# EAGLE design aether_A (EAGLE 5.11)
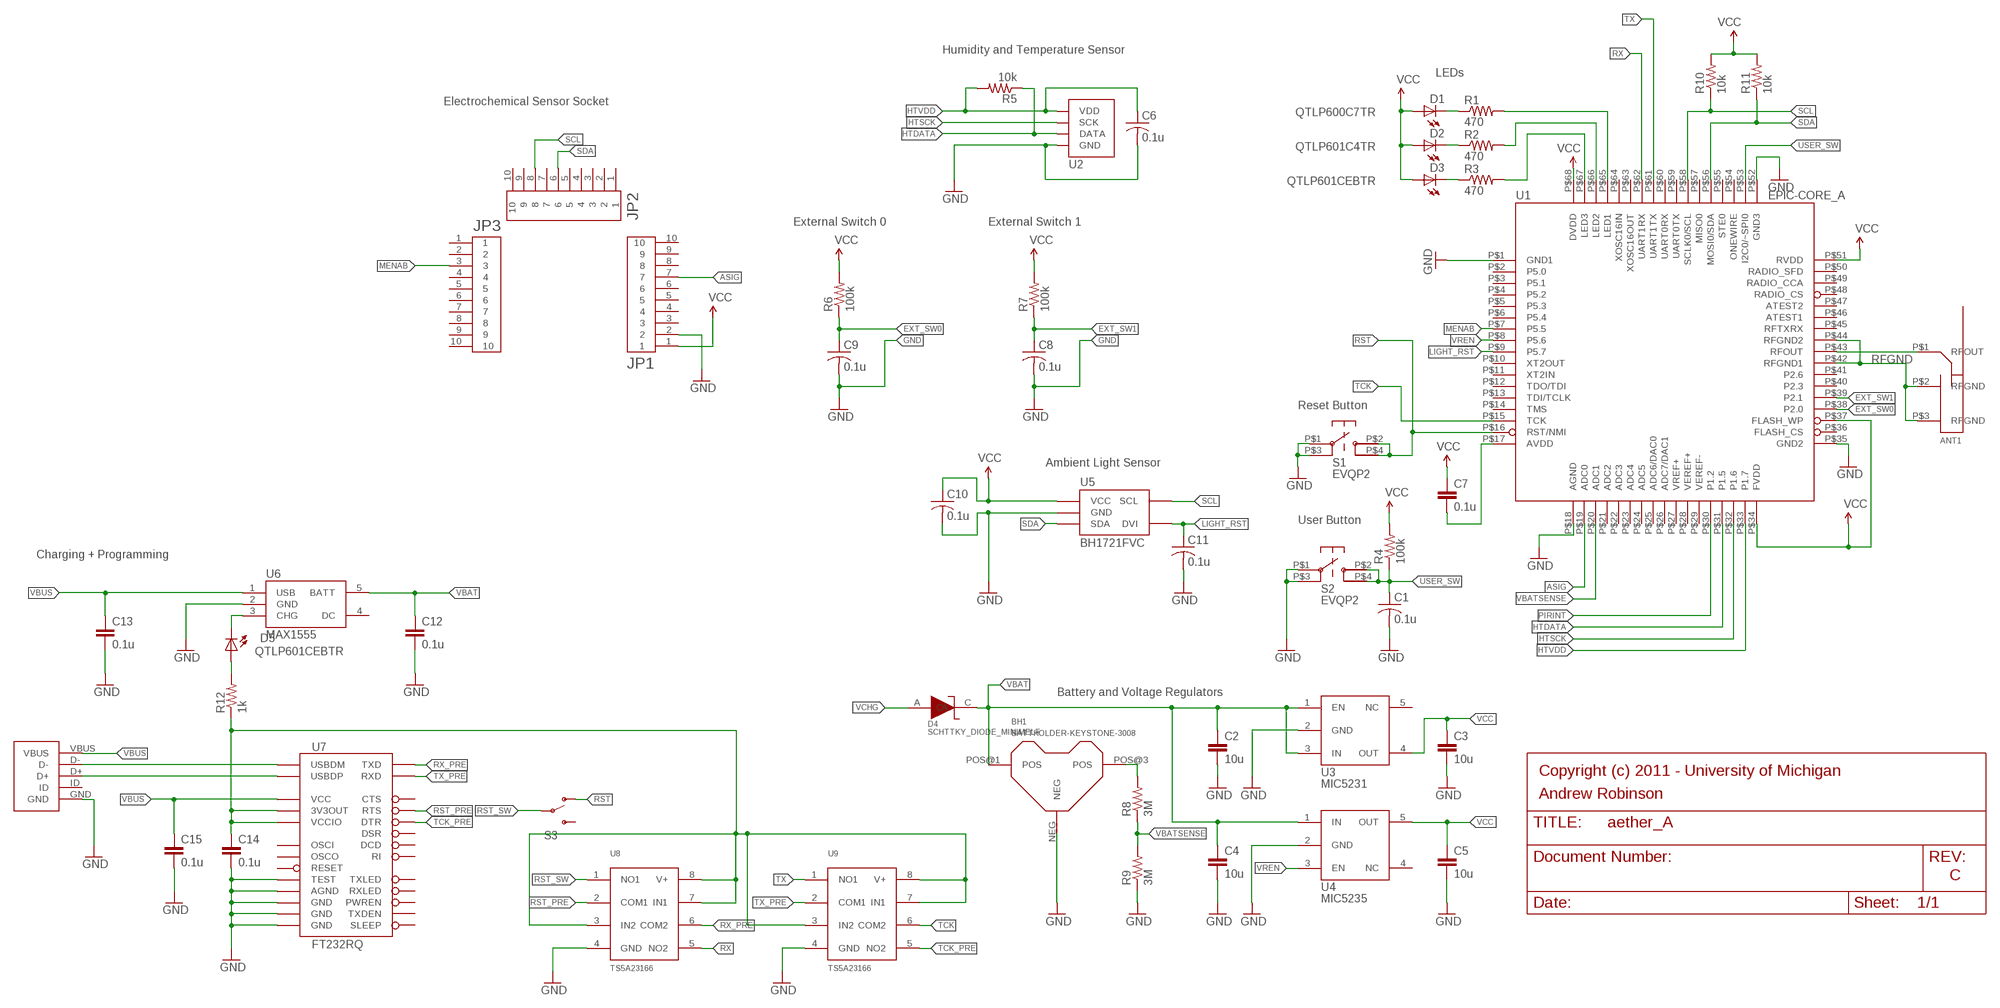
[diagram p0: schematic, sheet 1]

## Parts
ANT1  PIFA-2.4GHZ  [PIFA-2.4GHZ]
BH1  BATTHOLDER-KEYSTONE-3008  [BATTHOLDER-KEYSTONE-3008]
C1  0.1u  C-USC0603  [C0603]
C2  10u  C-EUC0603  [C0603]
C3  10u  C-EUC0603  [C0603]
C4  10u  C-EUC0603  [C0603]
C5  10u  C-EUC0603  [C0603]
C6  0.1u  C-USC0603  [C0603]
C7  0.1u  C-EUC0603  [C0603]
C8  0.1u  C-USC0603  [C0603]
C9  0.1u  C-USC0603  [C0603]
C10  0.1u  C-USC0603  [C0603]
C11  0.1u  C-USC0603  [C0603]
C12  0.1u  C-EUC0603  [C0603]
C13  0.1u  C-EUC0603  [C0603]
C14  0.1u  C-EUC0603  [C0603]
C15  0.1u  C-EUC0603  [C0603]
D1  QTLP600C7TR  LED0603  [LED-0603]
D2  QTLP601C4TR  LED0603  [LED-0603]
D3  QTLP601CEBTR  LED0603  [LED-0603]
D4  SCHTTKY_DIODE_MINIMELF  [SCHOTTKY_DIODE_MINIMELF]
D5  QTLP601CEBTR  LED0603  [LED-0603]
JP1  SAMTEC-2MM-SMT-10PINSTD  [2MM-10PIN-SMHEADER]
JP2  SAMTEC-2MM-SMT-10PINSTD  [2MM-10PIN-SMHEADER]
JP3  SAMTEC-2MM-SMT-10PINSTD  [2MM-10PIN-SMHEADER]
JP4  USB_MICRO_B_FEMALE  [USB_MICRO_B_FEMALE]
R1  470  R-US_R0603  [R0603]
R2  470  R-US_R0603  [R0603]
R3  470  R-US_R0603  [R0603]
R4  100k  R-US_R0603  [R0603]
R5  10k  R-US_R0603  [R0603]
R6  100k  R-US_R0603  [R0603]
R7  100k  R-US_R0603  [R0603]
R8  3M  R-US_R0603  [R0603]
R9  3M  R-US_R0603  [R0603]
R10  10k  R-US_R0603  [R0603]
R11  10k  R-US_R0603  [R0603]
R12  1k  R-US_R0603  [R0603]
S1  EVQP2  [EVQP2]
S2  EVQP2  [EVQP2]
S3  SWITCH-SPSTPTH  [SWITCH-SPDT]
U1  EPIC-CORE_A  [EPIC-LCC68]
U2  SHT1XSMD  [SHT1X]
U3  MIC5231  [SOT23-5]
U4  MIC5235  [SOT23-5]
U5  BH1721FVC  [WSOF5]
U6  MAX1555  [SOT23-5]
U7  FT232RQ  [QFN-32]
U8  TS5A23166  [WCSP-8]
U9  TS5A23166  [WCSP-8]

## Nets
ASIG: JP1.7 U1.P$19(ADC0)
EXT_SW0: C9.1 R6.1 U1.P$38(P2.0)
EXT_SW1: C8.1 R7.1 U1.P$39(P2.1)
GND: BH1.NEG C1.2 C2.2 C3.2 C4.2 C5.2 C6.2 C8.2 C9.2 C10.2 C11.2 C12.2 C13.2 C14.2 C15.2 JP1.2 JP4.GND R9.1 S1.P$1 S1.P$3 S2.P$1 S2.P$3 U1.P$1(GND1) U1.P$18(AGND) U1.P$35(GND2) U1.P$52(GND3) U2.1(GND) U3.2(GND) U4.2(GND) U5.GND U6.2(GND) U7.4(GND) U7.17(GND) U7.20(GND) U7.24(AGND) U7.26(TEST) U8.4(GND) U9.4(GND)
HTDATA: R5.1 U1.P$31(P1.5) U2.2(DATA)
HTSCK: U1.P$32(P1.6) U2.3(SCK)
HTVDD: C6.1 R5.2 U1.P$33(P1.7) U2.4(VDD)
LIGHT_RST: C11.1 U1.P$9(P5.7) U5.DVI
MENAB: JP3.3 U1.P$7(P5.5)
N$1: ANT1.P$1(RFOUT) U1.P$43(RFOUT)
N$2: C7.2 U1.P$17(AVDD)
N$3: C14.1 R12.1 U7.1(VCCIO) U7.16(3V3OUT) U8.3(IN2) U8.7(IN1) U8.8(V+) U9.3(IN2) U9.7(IN1) U9.8(V+)
N$4: JP4.D- U7.15(USBDM)
N$6: D1.C R1.1
N$7: D2.C R2.1
N$8: D3.C R3.1
N$9: R1.2 U1.P$65(LED1)
N$10: R2.2 U1.P$66(LED2)
N$11: R3.2 U1.P$67(LED3)
N$12: D5.C U6.3(CHG)
N$13: JP4.D+ U7.14(USBDP)
N$14: D5.A R12.2
N$16: BH1.POS@3(POS) R8.2
PIRINT: U1.P$30(P1.2)
RFGND: ANT1.P$2(RFGND) ANT1.P$3(RFGND) U1.P$42(RFGND1) U1.P$44(RFGND2)
RST: S1.P$2 S1.P$4 S3.1(O) U1.P$16(RST/NMI)
RST_PRE: U7.32(RTS) U8.2(COM1)
RST_SW: S3.2(P) U8.1(NO1)
RX: U1.P$62(UART1RX) U8.5(NO2)
RX_PRE: U7.30(TXD) U8.6(COM2)
SCL: JP2.8 R10.1 U1.P$58(SCLK0/SCL) U5.SCL
SDA: JP2.6 R11.1 U1.P$56(MOSI0/SDA) U5.SDA
TCK: U1.P$15(TCK) U9.6(COM2)
TCK_PRE: U7.31(DTR) U9.5(NO2)
TX: U1.P$61(UART1TX) U9.1(NO1)
TX_PRE: U7.2(RXD) U9.2(COM1)
USER_SW: C1.1 R4.1 S2.P$2 S2.P$4 U1.P$53(I2C0/~SPI0)
VBAT: BH1.POS@1(POS) C2.1 C4.1 C12.1 D4.C U3.1(EN) U3.3(IN) U4.1(IN) U6.5(BATT)
VBATSENSE: R8.1 R9.2 U1.P$20(ADC1)
VBUS: C13.1 C15.1 JP4.VBUS U6.1(USB) U7.19(VCC)
VCC: C3.1 C5.1 C7.1 C10.1 D1.A D2.A D3.A JP1.1 R4.2 R6.2 R7.2 R10.2 R11.2 U1.P$34(FVDD) U1.P$37(FLASH_WP) U1.P$51(RVDD) U1.P$68(DVDD) U3.4(OUT) U4.5(OUT) U5.VCC
VCHG: D4.A
VREN: U1.P$8(P5.6) U4.3(EN)
Unconnected: JP1.3 JP1.4 JP1.5 JP1.6 JP1.8 JP1.9 JP1.10 JP2.1 JP2.2 JP2.3 JP2.4 JP2.5 JP2.7 JP2.9 JP2.10 JP3.1 JP3.2 JP3.4 JP3.5 JP3.6 JP3.7 JP3.8 JP3.9 JP3.10 JP4.ID S3.3(S) U1.P$2(P5.0) U1.P$3(P5.1) U1.P$4(P5.2) U1.P$5(P5.3) U1.P$6(P5.4) U1.P$10(XT2OUT) U1.P$11(XT2IN) U1.P$12(TDO/TDI) U1.P$13(TDI/TCLK) U1.P$14(TMS) U1.P$21(ADC2) U1.P$22(ADC3) U1.P$23(ADC4) U1.P$24(ADC5) U1.P$25(ADC6/DAC0) U1.P$26(ADC7/DAC1) U1.P$27(VREF+) U1.P$28(VEREF+) U1.P$29(VEREF-) U1.P$36(FLASH_CS) U1.P$40(P2.3) U1.P$41(P2.6) U1.P$45(RFTXRX) U1.P$46(ATEST1) U1.P$47(ATEST2) U1.P$48(RADIO_CS) U1.P$49(RADIO_CCA) U1.P$50(RADIO_SFD) U1.P$54(ONEWIRE) U1.P$55(STE0) U1.P$57(MISO0) U1.P$59(UART0TX) U1.P$60(UART0RX) U1.P$63(XOSC16OUT) U1.P$64(XOSC16IN) U3.5(NC) U4.4(NC) U6.4(DC) U7.3(RI) U7.6(DSR) U7.7(DCD) U7.8(CTS) U7.9(SLEEP) U7.10(TXDEN) U7.11(PWREN) U7.18(RESET) U7.21(RXLED) U7.22(TXLED) U7.27(OSCI) U7.28(OSCO)

## Notes on the sheet
- Humidity and Temperature Sensor
- LEDs
- Electrochemical Sensor Socket
- External Switch 0 | External Switch 1
- Reset Button
- Ambient Light Sensor
- User Button
- Charging + Programming
- Battery and Voltage Regulators
- Copyright (c) 2011 - University of Michigan
- Andrew Robinson
- C

## Library data of the parts
ANT1 = berkeley-epic:PIFA-2.4GHZ
BH1 = berkeley-epic:BATTHOLDER-KEYSTONE-3008
C1 C6 C8-C11 = rcl:C-US: CAPACITOR, American symbol
C2-C5 C7 C12-C15 = rcl:C-EU: CAPACITOR, European symbol
D1-D3 D5 = berkeley-epic:LED: LEDs Standard schematic elements and footprints for 5mm, 3mm, 1206, and 0603 sized LEDs. 5mm - Spark Fun Electronics SKU : COM-00529 (and others)
D4 = berkeley-epic:SCHTTKY_DIODE_MINIMELF
JP1-JP3 = androbin_umich:SAMTEC-2MM-SMT-10PIN
JP4 = usb:USB_MICRO_B_FEMALE
R1-R12 = rcl:R-US_: RESISTOR, American symbol
S1 S2 = berkeley-epic:EVQP2
S3 = SparkFun:SWITCH-SPST: SPST Switch Simple slide switch. Spark Fun Electronics SKU : COM-00102
U1 = berkeley-epic:EPIC-CORE_A
U2 = berkeley-epic:SHT1X: SHT1x Humdity Sensor Sensirion humdity sensor. Schematic element and footprint proven. Spark Fun Electronics SKU : COM-08227
U3 = berkeley-epic:MIC5231
U4 = berkeley-epic:MIC5235
U5 = brad:BH1721FVC: Digital output type ambient light sensor IC is composed of photodiodes, current-voltage converter circuit, A / D converter, control logic circuits, interface circuits and etc. It connects with I2C BUS in an equipment.
U6 = SparkFun:MAX1555: MAX1555 Lithium Charger IC SOT-23 Lithium Polymer charging IC. Schematic element and footprint proven. Spark Fun Electronics SKU : COM-00674
U7 = SparkFun:FT232RQ: Non-stock item, unproven FP for this part.
U8 U9 = berkeley-epic:TS5A23166

## Board
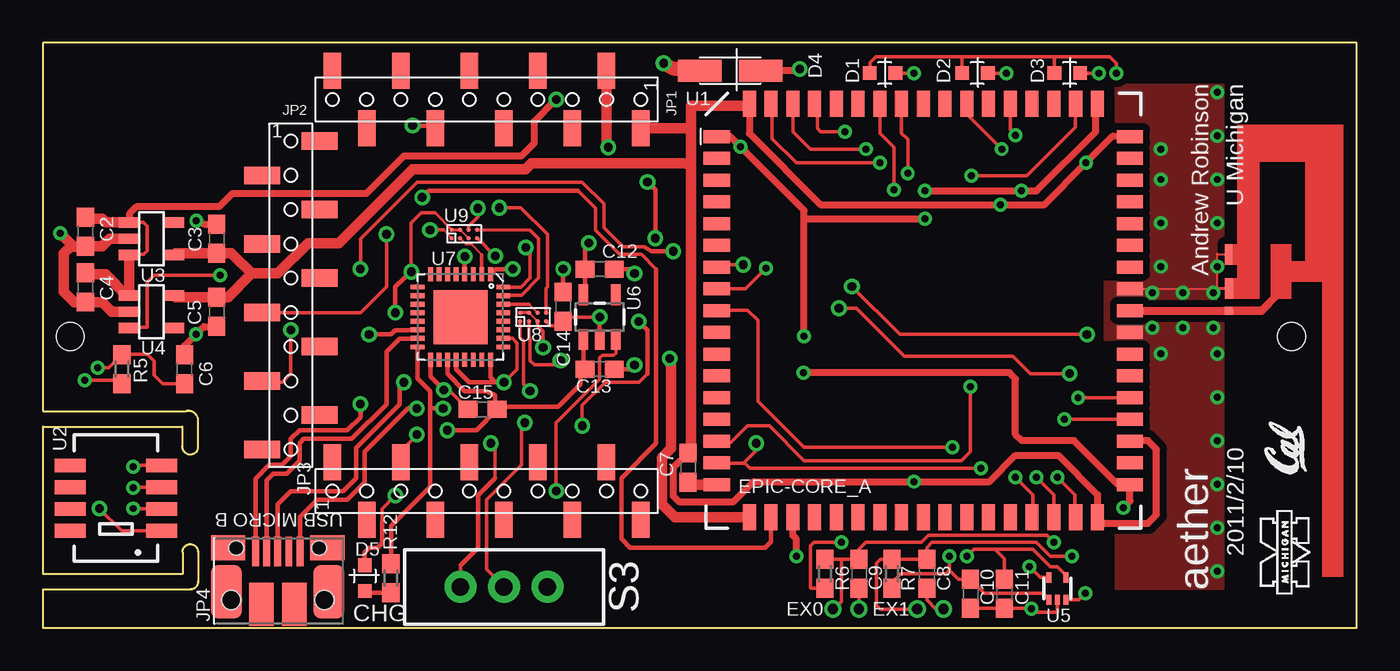
[diagram p1: board, top side]
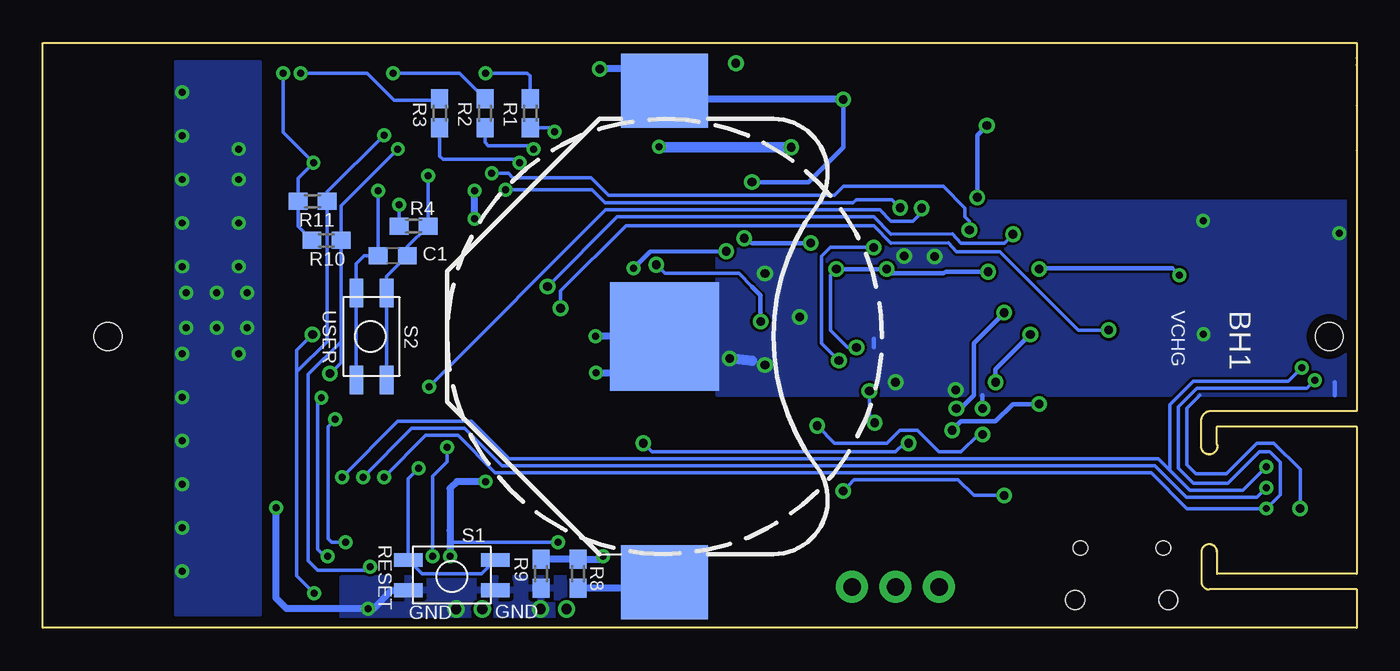
[diagram p2: board, bottom side, seen from below]

Size 76.71 x 34.14 mm. Coordinates in mm from the lower left corner, seen from the top.
Outline: 0,33.25 0,32.84
Outline: 0,30.48 0,27.86
Outline: 76.71,0 76.71,34.14 0,34.14 0,12.65 8.36,12.65 arc-90 9.07,12.19 9.07,10.46 arc-180 8.15,10.72 8.15,11.73 0,11.73 0,3.15 8.15,3.15 8.15,4.42 arc-180 9.07,4.42 9.07,2.69 arc-90 8.61,2.24 0,2.24 0,0 76.71,0
Copper layers (1*16): Top 0.0178mm / dielectric 1.4986mm / Bottom 0.0178mm
Design rules "SSC-EAGLE-2Lyr_v1.0.0.3 *": minimum track width 6mil, minimum drill 14mil, track to track 6mil, track to pad 6mil, pad to pad 6mil, via to via 6mil, smd to smd 6mil, copper to edge 20mil, drill to drill 16mil, minimum pad ring 8mil, minimum via ring 8mil, stop-mask expansion 3mil, vias tented up to drill 20mil, thermal gap 10mil
Holes 1.6 mm at 1.59,17 72.91,17

### Footprints (pad centres in the part's own frame; a part is rotated, then mirrored left to right if it is on the bottom)
PIFA-2.4GHZ = smd 0.46 x 0.46: P$1 -2.65,-1.495 | smd 0.46 x 1.2: P$2 -2.655,1.785; P$3 -2.65,-0.215
BATTHOLDER-KEYSTONE-3008 = smd 6.35 x 6.35: NEG 0,0 | smd 4.318 x 5.08: POS@1 -14.351,0; POS@3 14.351,0
C0603 = smd 1.1 x 1: 1 -0.85,0; 2 0.85,0
LED-0603 = smd 0.8 x 0.8: A 0,-0.75; C 0,0.75
SCHOTTKY_DIODE_MINIMELF = smd 2.54 x 1.27: A -1.778,0; C 1.778,0
2MM-10PIN-SMHEADER = smd 1.016 x 2.1: 1 -9,1.677; 2 -7,-1.677; 3 -5,1.677; 4 -3,-1.677; 5 -1,1.677; 6 1,-1.677; 7 3,1.677; 8 5,-1.677; 9 7,1.677; 10 9,-1.677
USB_MICRO_B_FEMALE = smd 0.4 x 1.75: D+ 0,2.825; D- -0.65,2.825; GND 1.3,2.825; ID 0.65,2.825; VBUS -1.3,2.825 | smd 1.425 x 2.5: P$6 0.963,-0.25; P$7 -0.963,-0.25 | smd 2 x 1.46: P$8 2.9,3.03; P$9 -2.9,3.03 | smd 1.825 x 3.15: P$10 2.987,0.475; P$11 -2.987,0.475 | hole 0.828: 2.425,3.03; -2.425,3.03 | hole 1.081: 2.725,0; -2.725,0
R0603 = smd 1.1 x 1: 1 -0.85,0; 2 0.85,0
EVQP2 = smd 1.676 x 0.813: P$1 -2.54,-0.87; P$2 -2.54,0.908; P$3 2.54,-0.87; P$4 2.54,0.908
SWITCH-SPDT = drill 1.016 pad 1.88 round: 1 0,2.54; 2 0,0; 3 0,-2.54
EPIC-LCC68 = smd 1.524 x 0.762: P$1 -12.065,10.16; P$2 -12.065,8.89; P$3 -12.065,7.62; P$4 -12.065,6.35; P$5 -12.065,5.08; P$6 -12.065,3.81; P$7 -12.065,2.54; P$8 -12.065,1.27; P$9 -12.065,0; P$10 -12.065,-1.27; P$11 -12.065,-2.54; P$12 -12.065,-3.81; P$13 -12.065,-5.08; P$14 -12.065,-6.35; P$15 -12.065,-7.62; P$16 -12.065,-8.89; P$17 -12.065,-10.16; P$35 12.065,-10.16; P$36 12.065,-8.89; P$37 12.065,-7.62; P$38 12.065,-6.35; P$39 12.065,-5.08; P$40 12.065,-3.81; P$41 12.065,-2.54; P$42 12.065,-1.27; P$43 12.065,0; P$44 12.065,1.27; P$45 12.065,2.54; P$46 12.065,3.81; P$47 12.065,5.08; P$48 12.065,6.35; P$49 12.065,7.62; P$50 12.065,8.89; P$51 12.065,10.16 | smd 0.762 x 1.524: P$18 -10.16,-12.065; P$19 -8.89,-12.065; P$20 -7.62,-12.065; P$21 -6.35,-12.065; P$22 -5.08,-12.065; P$23 -3.81,-12.065; P$24 -2.54,-12.065; P$25 -1.27,-12.065; P$26 0,-12.065; P$27 1.27,-12.065; P$28 2.54,-12.065; P$29 3.81,-12.065; P$30 5.08,-12.065; P$31 6.35,-12.065; P$32 7.62,-12.065; P$33 8.89,-12.065; P$34 10.16,-12.065; P$52 10.16,12.065; P$53 8.89,12.065; P$54 7.62,12.065; P$55 6.35,12.065; P$56 5.08,12.065; P$57 3.81,12.065; P$58 2.54,12.065; P$59 1.27,12.065; P$60 0,12.065; P$61 -1.27,12.065; P$62 -2.54,12.065; P$63 -3.81,12.065; P$64 -5.08,12.065; P$65 -6.35,12.065; P$66 -7.62,12.065; P$67 -8.89,12.065; P$68 -10.16,12.065
SHT1X = smd 1.8 x 0.8: 1 -2.667,1.905; 2 -2.667,0.635; 3 -2.667,-0.635; 4 -2.667,-1.905; 5 2.667,-1.905; 6 2.667,-0.635; 7 2.667,0.635; 8 2.667,1.905
SOT23-5 = smd 0.6 x 1.2: 1 -0.95,-1.306; 2 0,-1.306; 3 0.95,-1.306; 4 0.95,1.306; 5 -0.95,1.306
WSOF5 = smd 0.3 x 0.6: DVI 0.5,0.65; GND 0,-0.65; SCL -0.5,0.65; SDA 0.5,-0.65; VCC -0.5,-0.65
SOT23-5' = smd 0.55 x 1.2: 1 -0.95,-1.3; 2 0,-1.3; 3 0.95,-1.3; 4 0.95,1.3; 5 -0.95,1.3
QFN-32 = smd 0.285 x 0.8: 1 -1.75,-2.5; 2 -1.25,-2.5; 3 -0.75,-2.5; 4 -0.25,-2.5; 5 0.25,-2.5; 6 0.75,-2.5; 7 1.25,-2.5; 8 1.75,-2.5; 17 1.75,2.5; 18 1.25,2.5; 19 0.75,2.5; 20 0.25,2.5; 21 -0.25,2.5; 22 -0.75,2.5; 23 -1.25,2.5; 24 -1.75,2.5 | smd 0.8 x 0.285: 9 2.5,-1.75; 10 2.5,-1.25; 11 2.5,-0.75; 12 2.5,-0.25; 13 2.5,0.25; 14 2.5,0.75; 15 2.5,1.25; 16 2.5,1.75; 25 -2.5,1.75; 26 -2.5,1.25; 27 -2.5,0.75; 28 -2.5,0.25; 29 -2.5,-0.25; 30 -2.5,-0.75; 31 -2.5,-1.25; 32 -2.5,-1.75 | smd 3.15 x 3.15: EP 0,0
WCSP-8 = smd 0.25 x 0.25: 1 -0.25,0.75; 2 -0.25,0.25; 3 -0.25,-0.25; 4 -0.25,-0.75; 5 0.25,-0.75; 6 0.25,-0.25; 7 0.25,0.25; 8 0.25,0.75

### Placement (x,y rotation side)
ANT1  71.88,20 0 top
BH1  40.41,17 270 bottom
C1  56.28,21.72 180 bottom
C2  2.49,23.11 270 top
C3  10.16,22.71 90 top
C4  2.49,19.86 270 top
C5  10.16,18.44 270 top
C6  8.28,15.09 90 top
C7  37.67,9.35 270 top
C8  51.61,3.15 270 top
C9  47.65,3.15 270 top
C10  54.15,1.98 270 top
C11  56.13,1.98 270 top
C12  32.51,20.93 0 top
C13  32.51,15.09 0 top
C14  30.38,18.75 270 top
C15  25.68,12.75 180 top
D1  49.03,32.37 270 top
D2  54.42,32.37 270 top
D3  59.81,32.37 270 top
D4  40.13,32.51 0 top
D5  18.8,2.9 0 top
JP1  25.91,30.84 180 top
JP2  14.48,19.41 270 top
JP3  25.91,7.98 0 top
JP4  13.72,1.63 0 top
R1  48.25,30.03 270 bottom
R2  50.89,30.03 270 bottom
R3  53.53,30.03 270 bottom
R4  55.06,23.44 180 bottom
R5  4.62,15.09 90 top
R6  45.67,3.15 270 top
R7  49.58,3.15 270 top
R8  45.47,3.15 270 bottom
R9  47.62,3.15 90 bottom
R10  60.15,22.61 180 bottom
R11  60.96,24.89 180 bottom
R12  20.32,2.9 270 top
S1  52.83,3.05 0 bottom
S2  57.53,17 270 bottom
S3  26.92,2.39 90 top
U1  51.41,18.51 0 top
U2  4.27,7.57 180 top
U3  6.35,22.71 270 top
U4  6.35,18.44 270 top
U5  59.23,2.29 0 top
U6  MAX1555  [SOT23-5']  32.51,18.14 0 top
U7  24.38,18.14 180 top
U8  28.63,18.14 90 top
U9  24.61,22.99 90 top
U$1  [UMICH]  74.17,1.88 90 top
U$3  [CAL1]  74.17,8.89 90 top

### Tracks (layer width: path | path; a pad name or v marks a point on that pad's centre or on a via)
ASIG  (via drill 0.51)
  Top 0.203: 35.81,20.93 34.95,21.79 33.68,21.79 32.26,23.19 32.26,24.49 31.24,25.5
  Top 0.254: U1.P$19 42.52,5.03 42.16,4.67 34.29,4.67 33.78,5.18 33.78,8.74 35.81,10.77 35.81,20.93 | 31.24,25.5 22.53,25.5 v22.15,25.12 | v21.59,29.31 22.75,29.31 JP1.7
  Bottom 0.254: v22.15,25.12 22.15,28.75 v21.59,29.31
EXT_SW0  (via drill 0.41, 0.41 pad 0.79, 0.6)
  Top 0.203: v59.63,12.16 U1.P$38 | v59.03,4.98 58.62,5.38 51.71,5.38 51.31,4.98 48.06,4.98 47.65,4.57 C9.1 46.63,4 | R6.1 46.63,4 | v46.13,1.09 46.2,1.09 46.63,1.52 46.63,4
  Bottom 0.203: v59.63,12.16 60.05,11.74 60.05,5.18 59.84,4.98 v59.03,4.98
EXT_SW1  (via drill 0.41, 0.41 pad 0.79, 0.6)
  Top 0.203: v60.45,13.43 U1.P$39 | v60.07,4.17 58.83,4.17 58.01,4.98 51.92,4.98 51.61,4.67 C8.1 R7.1 48.91,4 48.67,3.76 48.67,1.32 48.9,1.09 v51.05,1.09
  Bottom 0.203: v60.45,13.43 60.66,13.22 60.66,4.57 60.25,4.17 v60.07,4.17
GND  (via drill 0.41, 0.41 pad 0.79, 0.51, 0.6)
  Top 0.203: U5.GND 59.23,0.91 57.91,0.91 v57.71,1.12 57.7,1.13 C11.2 C10.2 | C8.2 51.61,1.63 52.15,1.09 v52.58,1.09 | C9.2 v47.65,1.09 | 7.39,5.66 U2.1 4.6,5.66 v3.3,6.96 | v23.42,13.87 23.71,13.87 C15.2 | 10.16,17.58 C5.2 | U9.4 v26.42,21.69 | U8.4 29.64,17.63 30.14,17.63 | 30.14,17.63 C14.2 | U7.26 27.41,16.89 27.69,16.61 27.69,15.09 v26.92,14.33 | 30.14,17.63 30.23,17.63 30.73,18.14 v32.51,18.14
  Top 0.254: JP4.GND 15.02,6.48 16,7.47 17.78,7.47 18.8,8.48 18.8,10.26 21.34,12.8 v21.84,12.8 | U7.17 22.63,14.65 v23.42,13.87 | C12.2 34.29,20.93 v34.54,20.68 | C13.2 34.29,15.09 v34.54,15.34 | v32.51,18.14 U6.2 | U7.20 24.13,15.08 24.89,14.33 26.42,14.33 | 26.42,14.33 v26.92,14.33 | U7.24 26.13,14.61 26.42,14.33 | C15.2 24.8,12.89 | C14.2 30.57,17.88 | U7.4 24.63,21.43 24.64,21.44 v24.64,21.67
  Top 0.406: U3.2 4.94,22.61 | U1.P$52 61.47,30.47 61.47,28.96 58.01,25.5 v57.13,25.5 v51.51,25.5 | v63.09,7.01 63.47,7.39 U1.P$35 62.77,8.35 60.2,10.92 57.15,10.92 56.79,11.28 56.79,14.53 56.44,14.88 v44.4,14.88 | v44.45,17.02 44.45,23.88 | 44.45,23.88 44.45,24.36 v40.74,28.07 40.14,28.67 U1.P$1 | C3.2 9.41,23.56 v8.97,23.75 | 10.16,17.58 9.4,17.58 v8.94,17.12 8.28,16.46 C6.2 | 44.45,23.88 v51.51,23.88
  Top 0.61: U4.2 4.01,18.44 3.45,19 2.5,19 | C4.2 2.5,19 | 2.5,19 1.83,19 1.22,19.61 1.22,21.84 1.63,22.25 | 1.63,22.25 2.48,22.25 C2.2 3.47,22.26 3.91,22.71 U3.2 | 1.63,22.25 1.63,22.4 v1.02,23.01 | U1.P$18 36.91,6.44 36.14,7.21 36.14,9.93 36.68,10.46 36.68,15.24 v36.6,15.72 | JP1.2 32.91,28.15 v33.02,28.04
  Bottom 0.203: S2.P$3 S2.P$1 58.42,19.56 58.42,21.23 57.94,21.72 C1.2 v57.13,25.5 | v3.3,6.96 3.3,9.25 4.83,10.77 5.84,10.77 7.62,8.99 9.4,8.99 9.91,9.5 9.91,12.8 9.14,13.56
  Bottom 0.254: 1.27,14.33 1.27,13.56 | v21.84,12.8 21.84,13.56 | 28.19,16.36 28.19,16.87
  Bottom 0.406: v44.45,17.02 40.39,17.02 BH1.NEG 42.52,14.88 v44.4,14.88 | v51.51,23.88 v51.51,25.5 | v63.09,7.01 63.09,1.73 62.48,1.12 v57.71,1.12 57.4,1.12 56.37,2.15 S1.P$1
  Bottom 0.61: v36.6,15.72 35.31,15.6 | v33.02,28.04 40.72,28.04 v40.74,28.07
  pour Bottom (isolate 0.127, no thermals): 0.51,13.56 0.51,24.89 37.34,24.89 37.34,13.56
  pour Bottom: 43.43,0.36 59.18,0.36 59.18,2.9 43.43,2.9
HTDATA  (via drill 0.41)
  Top 0.203: U1.P$31 57.81,6.5 57.81,7.77 v56.79,8.79 | U2.2 5.31,6.93 v5.28,6.96 | 4.47,14.2 4.51,14.24 R5.1 4.41,14.45 v2.44,14.45
  Bottom 0.203: v56.79,8.79 54.36,11.23 52.48,11.23 50.29,9.04 11.99,9.04 9.91,6.96 v5.28,6.96 4.47,7.77 4.47,9.65 5.08,10.26 5.69,10.26 7.52,8.43 9.55,8.43 10.41,9.3 10.41,12.9 9.35,13.97 2.92,13.97 v2.44,14.45
HTSCK  (via drill 0.41)
  Top 0.203: U1.P$32 59.03,7.77 v58.01,8.79 | U2.3 5.31,8.2 v5.28,8.18
  Bottom 0.203: v58.01,8.79 55.17,11.63 52.07,11.63 49.89,9.45 11.79,9.45 9.96,7.62 5.84,7.62 v5.28,8.18
HTVDD  (via drill 0.41)
  Top 0.203: U1.P$33 60.25,6.49 60.25,7.77 v59.23,8.79 | U2.4 5.36,9.47 v5.28,9.4 | C6.1 7,14.24 6.5,14.73 6.5,15.54 6.1,15.95 4.64,15.95 R5.2 3.86,15.18 v3.2,15.18
  Bottom 0.203: v59.23,8.79 55.98,12.04 51.66,12.04 49.48,9.86 11.58,9.86 10.92,9.19 | 10.92,9.19 9.75,8.03 6.66,8.03 v5.28,9.4 | 10.92,9.19 10.92,13 9.55,14.38 4,14.38 v3.2,15.18
LIGHT_RST  (via drill 0.41)
  Top 0.203: U1.P$9 39.38,18.54 41.15,18.54 41.76,17.93 41.76,13.21 44.44,10.52 v53.11,10.52 | U5.DVI 59.73,3.06 59.23,3.56 58.83,3.56 57.81,4.57 55.58,4.57 | 55.58,4.57 54.36,4.57 v53.95,4.17 | C11.1 56.13,4.01 55.58,4.57
  Bottom 0.203: v53.11,10.52 53.11,9.68 53.95,8.84 v53.95,4.17
MENAB  (via drill 0.51)
  Top 0.203: v40.89,21.18 39.48,21.18 U1.P$7 | 35.31,14.83 34.8,14.33 32.84,14.33 31.5,12.98 v31.5,11.79 | JP3.3 20.91,10.34 v21.84,11.28
  Top 0.254: 35.31,14.83 35.31,17.37 v34.8,17.88
  Bottom 0.203: v40.89,21.18 40.39,20.68 36.07,20.68 35.31,19.91 | v31.5,11.79 30.48,10.77 27.43,10.77 26.67,11.53 25.65,11.53 24.38,10.26 23.11,10.26 22.1,11.28 v21.84,11.28
  Bottom 0.254: v34.8,17.88 34.8,19.41 35.31,19.91
N$1
  Top 0.406: 69.22,18.51 69.22,18.48 | 69.22,18.51 ANT1.P$1 | 69.22,18.51
  Top 0.47: U1.P$43 69.22,18.51
N$2
  Top 0.61: U1.P$17 37.82,8.35 C7.2
N$3  (via drill 0.51)
  Top 0.152: U9.7 U9.3 | U8.3 U8.7
  Top 0.165: U9.7 U9.8 22.89,24.23 | U8.7 U8.8
  Top 0.203: v21.51,20.78 21.51,23.65 22.1,24.23 22.89,24.23 | U8.3 28.88,17.63 29.21,17.3 v29.21,16.36
  Top 0.254: R12.1 20.32,5.94 22.61,8.23 22.61,12.8 | U7.16 21.88,14.54 22.61,13.82 22.61,12.8 | 22.61,12.8 v23.37,12.8 | v27.43,20.93 26.43,20.93 U7.1 | v30.38,20.93 C14.1 | v20.57,18.39 20.57,19.91 v21.51,20.78
  Bottom 0.203: v29.21,16.36 29.72,16.36 30.73,17.37 30.73,20.57 v30.38,20.93
  Bottom 0.254: v30.38,20.93 v27.43,20.93 27.18,20.68 24.13,20.68 23.98,20.78 v21.51,20.78 | v23.37,12.8 23.11,12.8 22.35,13.56 22.35,16.61 v20.57,18.39
N$4
  Top 0.254: JP4.D- 13.07,8.6 13.46,8.99 14.22,8.99 14.99,9.75 14.99,10.77 15.24,11.02 18.03,11.02 20.07,13.06 20.07,16.1 20.83,16.87 21.36,16.87 U7.15
N$6  (via drill 0.41)
  Top 0.203: v50.87,32.37 D1.C
  Bottom 0.203: v50.87,32.37 48.43,32.37 48.26,32.21 R1.1
N$7  (via drill 0.41)
  Top 0.203: v56.26,32.37 D2.C
  Bottom 0.203: v56.26,32.37 52.38,32.37 R2.1
N$8  (via drill 0.41)
  Top 0.203: v61.65,32.37 D3.C
  Bottom 0.203: v61.65,32.37 57.77,32.37 56.19,30.78 53.63,30.78 R3.1
N$9  (via drill 0.41)
  Top 0.203: v46.84,28.96 45.41,28.96 45.21,29.16 45.21,30.42 U1.P$65
  Bottom 0.203: R1.2 47.06,29.18 v46.84,28.96
N$10  (via drill 0.41)
  Top 0.203: v48.06,27.94 44.81,27.94 43.79,28.96 U1.P$66
  Bottom 0.203: R2.2 50.89,28.34 50.7,28.14 48.26,28.14 v48.06,27.94
N$11  (via drill 0.41)
  Top 0.203: U1.P$67 42.57,30.52 42.57,28.55 43.99,27.13 v48.87,27.13
  Bottom 0.203: R3.2 53.53,27.52 53.34,27.33 49.07,27.33 v48.87,27.13
N$12  (via drill 0.51)
  Top 0.203: 19.81,6.2 19.81,6.96 v20.57,7.72 | v29.97,7.98 29.97,11.96 32.51,14.5 32.51,15.75 32.66,15.9 33.33,15.9 33.45,16.03 U6.3 33.53,16.9 33.53,16.66
  Top 0.254: D5.C 18.8,4.42 19.05,4.67 19.56,4.67 19.81,4.93 19.81,6.2
  Bottom 0.203: v20.57,7.72 22.35,7.72 23.29,8.64 29.34,8.64 v29.97,7.98
N$13  (via drill 0.51)
  Top 0.254: JP4.D+ 13.72,7.21 14.48,7.98 17.53,7.98 18.29,8.74 18.29,10.52 20.83,13.06 20.83,14.07 v21.08,14.33 | v19.05,17.12 20.32,17.12 20.57,17.37 21.36,17.37 U7.14
  Bottom 0.254: v21.08,14.33 21.08,15.09 v19.05,17.12
N$14
  Top 0.254: R12.2 18.9,2.05 D5.A
N$16
  Bottom 0.406: R8.2 40.76,2.3 BH1.POS@3
PIRINT
  Top 0.203: U1.P$30 56.39,6.54
RFGND  (via drill 0.41)
  Top 0.127: 68.58,21.79 ANT1.P$2 | 68.58,21.79 68.58,21.84 | 68.58,21.79 v68.58,21.08 68.58,19.81 69.34,19.81 69.34,19.79 ANT1.P$3 63.5,19.79 63.5,19.81 | 63.5,17.24 63.5,17.27 | U1.P$42 63.5,17.24 | 63.5,17.24 63.5,17.21
  other vias: 65.28,26.16 65.28,27.94 65.28,23.62 65.28,21.08 68.58,28.7 68.58,26.16 68.58,23.62 64.77,19.56 66.55,19.56 68.33,19.56 64.77,17.5 66.55,17.5 68.33,17.5 68.58,16 65.28,16 68.58,13.46 68.58,10.92 68.58,8.38 68.58,5.84 68.58,3.3 68.58,31.24
  pour Top (isolate 0.406, no thermals): 68.96,2.29 68.96,31.69 62.61,31.69 62.61,20.19 61.98,20.19 61.98,16.82 62.61,16.82 62.61,2.29
  pour Bottom: 68.96,0.76 68.96,33.02 64.01,33.02 64.01,0.76
RST  (via drill 0.41, 0.51)
  Top 0.203: U1.P$16 39.37,9.65 39.42,9.6 40.89,9.6 | 40.89,9.6 41,9.6 41.28,9.31 v54.76,9.31 | 26.42,8.74 26.42,10.52 v26.16,10.77 | v41.66,10.77 41.66,10.36 40.89,9.6 | S3.1 24.38,3.66
  Top 0.254: 24.38,3.66 25.4,4.67 25.4,7.72 26.42,8.74
  Bottom 0.203: v54.76,9.31 55.37,8.7 S1.P$2 54.57,3.15 51.1,3.15 S1.P$4 | v26.16,10.77 26.42,10.77 26.92,10.26 41.15,10.26 v41.66,10.77
RST_PRE  (via drill 0.51)
  Top 0.203: U7.32 27.91,19.89 28.45,20.42 28.45,21.95 v28.19,22.2 | U8.2 28.38,16.94 28.45,16.87 28.45,15.6 28.7,15.34 29.97,15.34 v30.23,15.6
  Bottom 0.203: v28.19,22.2 30.73,22.2 31.24,21.69 31.24,16.61 v30.23,15.6
RST_SW  (via drill 0.51)
  Top 0.203: U8.1 27.88,16.93 28.07,16.74 28.07,14.2 v28.45,13.82 | S3.2 25.91,3.4 25.91,7.47 27.94,9.5 27.94,11.76 v28.14,11.96
  Bottom 0.203: v28.45,13.82 28.45,12.29 v28.14,11.96
RX  (via drill 0.41, 0.51)
  Top 0.203: U1.P$62 48.87,28.86 49.68,28.04 v49.68,25.55 | v26.64,24.51 27.89,24.51 29.46,22.96 29.46,19.91 29.38,19.83 U8.5
  Bottom 0.203: v49.68,25.55 44.65,25.55 43.89,24.79 29.41,24.79 29.21,24.99 27.13,24.99 v26.64,24.51
RX_PRE
  Top 0.152: 28.38,18.89 U8.6
  Top 0.203: U7.30 28.38,18.89
SCL  (via drill 0.41, 0.51)
  Top 0.203: U1.P$58 53.95,29.97 v55.98,27.94 | U5.SCL 58.23,2.94 v57.61,3.56 | v59.94,14.83 57.66,14.83 56.64,15.85 50.29,15.85 47.5,18.64 v46.48,18.64 | v14.48,17.37 14.48,14.83 13.97,14.33 12.88,14.33 JP2.8
  Bottom 0.203: v55.98,27.94 59.3,24.62 R10.1 59.3,16.7 | 59.3,16.7 61.21,14.78 61.21,3.91 60.66,3.35 57.81,3.35 v57.61,3.56 | 59.3,16.7 59.3,15.48 v59.94,14.83 | v46.48,18.64 46.48,19.66 42.67,23.47 28.19,23.47 27.18,22.45 23.85,22.48 23.37,21.95 20.83,21.95 16.26,17.37 v14.48,17.37
SDA  (via drill 0.41, 0.51)
  Top 0.203: U1.P$56 56.49,29.06 v56.79,28.75 | U5.SDA 60.49,1.64 v60.86,2.01 | v60.96,17.12 50.04,17.12 v47.24,19.91 | v20.07,22.96 20.07,19.91 18.54,18.39 12.82,18.39 JP2.6
  Bottom 0.203: v56.79,28.75 60.11,25.44 R11.1 60.11,16.7 61.87,14.94 | 61.87,14.94 61.87,3.02 v60.86,2.01 | 61.87,14.94 61.87,16.21 v60.96,17.12 | v47.24,19.91 43.18,23.98 28.19,23.98 27.18,22.96 23.6,22.99 23.11,22.45 20.57,22.45 v20.07,22.96
TCK  (via drill 0.41, 0.51)
  Top 0.203: U1.P$15 39.41,10.82 40.18,10.82 41.15,11.79 42.42,11.79 44.45,9.75 53.65,9.75 54.15,10.26 v54.15,14.07 | 25.39,24.47 v25.4,24.49 25.4,23.98 24.86,23.44 U9.6
  Bottom 0.203: v54.15,14.07 43.84,24.38 27.84,24.38 27.18,23.72 25.91,23.72 25.4,24.23 v25.4,24.49
TCK_PRE
  Top 0.203: U9.5 28.45,23.21 28.96,22.71 28.96,20.42 27.94,19.41 26.9,19.41 U7.31
TX  (via drill 0.41, 0.51)
  Top 0.152: U9.1 23.38,23.22
  Top 0.203: U1.P$61 50.14,28.86 50.49,28.5 v50.49,26.52 | U9.1 | 23.38,23.22 v22.61,23.22
  Bottom 0.203: v50.49,26.52 49.53,26.52 49.28,26.26 44.7,26.26 43.69,25.25 30.48,25.25 29.97,25.76 24.13,25.76 22.86,24.49 22.86,23.98 22.61,23.72 v22.61,23.22
TX_PRE
  Top 0.152: 24.36,22.73 24.71,22.38 25.02,22.38 25.63,21.77
  Top 0.203: U9.2 24.36,22.73 | 25.63,21.77 U7.2
USER_SW  (via drill 0.41)
  Top 0.203: U1.P$53 60.3,29.21 57.46,26.37 v54.21,26.37
  Bottom 0.203: S2.P$4 S2.P$2 56.63,20.52 C1.1 55.43,22.22 R4.1 v54.21,26.37
VBAT  (via drill 0.51)
  Top 0.203: U3.1 5.86,23.66 6.1,23.42 6.1,22 5.89,21.79 5.08,21.79 U3.3
  Top 0.254: U6.5 31.66,19.28 C12.1 31.66,22.26 v31.88,22.45 | v35.76,22.73 35.76,25.55 v35.31,26.01
  Top 0.406: U3.1 5.08,23.69 5.08,24.18 5.49,24.59 10.31,24.59 11.07,25.35 18.9,25.35 21.08,27.53 27.94,27.53 28.7,28.3 28.7,29.57 v29.97,30.84 | D4.C 44.09,32.51 v44.2,32.61
  Top 0.61: U3.3 U4.1 4.89,19.39 3.66,20.62 2.58,20.62 C4.1 | U3.1 3.67,23.66 3.45,23.88 2.58,23.88 C2.1
  Bottom 0.254: v31.88,22.45 35.31,22.45 v35.76,22.73 | v35.31,26.01 32,26.01 29.97,28.04 v29.97,30.84
  Bottom 0.406: v44.2,32.61 41.67,32.61 BH1.POS@1 39.89,30.84 v29.97,30.84
VBATSENSE  (via drill 0.41)
  Top 0.406: v43.99,4.17 43.99,5.18 43.79,5.38 U1.P$20
  Bottom 0.406: R9.2 R8.1 44.16,4 v43.99,4.17
VBUS  (via drill 0.51)
  Top 0.254: JP4.VBUS 12.42,8.71 13.21,9.5 13.97,9.5 14.48,10.01 14.48,11.02 14.99,11.53 17.78,11.53 18.54,12.29 v18.54,13.06 | U6.1 31.56,15.19 C13.1 31.39,15.07 31.39,14.2 30.09,12.89 26.42,12.89 | U7.19 23.63,14.82 24.64,13.82 25.91,13.82 26.42,13.56 26.42,12.89 | 26.42,12.89 C15.1 25.31,11.53 v23.62,11.53
  Bottom 0.254: v18.54,13.06 20.07,13.06 21.08,12.04 23.11,12.04 v23.62,11.53
VCC  (via drill 0.41)
  Top 0.203: 37.84,29.79 37.82,30.2 | 53.67,33.32 48.64,33.32 48.28,32.97 D1.A | v62.69,32.37 62.69,32.94 62.3,33.32 59.06,33.32 | 59.06,33.32 D3.A | 53.67,33.32 D2.A | 59.06,33.32 53.67,33.32 | U5.VCC 58.36,2.01 54.98,2.01 C10.1 53.45,2.83 52.93,3.35 | v52.93,4.17 52.93,3.35 | 52.93,3.35 52.73,3.15 50.09,3.15 49.58,2.64 R7.2 | R6.2 44.84,2.3 44.81,2.34 44.81,4.78 45.01,4.98 v46.63,4.98
  Top 0.305: 63.5,10.92 U1.P$37
  Top 0.406: 37.84,30.21 37.84,30.48 | 41.15,30.48 41.2,30.58 41.21,30.57 U1.P$68 41.25,28.86 45.41,24.69 v55.91,24.69 58.47,24.69 v60.91,27.13 62.48,28.7 U1.P$51 | U1.P$37 63.47,10.92 63.5,10.92 64.52,10.92 65.02,10.41 65.02,6.6 64.52,6.1 61.59,6.1 61.59,6.41 U1.P$34 61.57,7.77 59.28,10.06 56.79,10.06 55.27,8.53 v50.85,8.53 41.5,8.53 40.34,7.37 37.13,7.37 36.8,7.7 36.8,9.33 C7.1
  Top 0.61: 37.84,30.48 38.35,30.48 41.15,30.48 | 37.84,27.03 37.85,21.59 37.85,20.42 37.85,19.56 37.85,13.46 37.85,10.45 C7.1 | 37.84,27.03 37.84,29.06 | 37.84,29.06 37.84,29.79 37.84,30.21 | U4.5 7.76,19.29 C5.1 10.81,19.29 12.19,20.68 | U3.4 7.76,21.86 C3.1 11.01,21.86 12.19,20.68 | 12.19,20.68 13.72,20.68 15.49,22.45 17.27,22.45 21.59,26.77 28.19,26.77 28.52,27.1 37.39,27.1 37.84,27.03 | JP1.1 37.74,29.16 37.84,29.06
  Bottom 0.203: v62.69,32.37 62.69,28.91 v60.91,27.13 61.81,26.23 R11.2 61.81,23.42 R10.2 | v55.91,24.69 R4.2 | v46.63,4.98 52.93,4.98 52.93,5.69
  Bottom 0.406: v52.93,4.17 52.93,5.69 52.93,8.13 52.53,8.53 v50.85,8.53
VCHG  (via drill 0.51 pad 0.94)
  Top 0.305: 38.23,32.64 D4.A 38.35,32.38
  Top 0.813: 38.23,32.64 36.83,32.64 v36.25,32.94
VREN  (via drill 0.41, 0.51)
  Top 0.203: U4.3 5.08,17.53 6.1,17.53 6.1,20.17 6.5,20.57 v10.36,20.57 | v18.54,20.93 18.54,22.71 21.84,26.01 31.5,26.01 32.77,24.74 32.77,23.34 33.88,22.22 35.1,22.22 35.53,21.97 | U1.P$8 41.01,19.78 v42.22,20.98
  Top 0.254: 35.53,21.97 v36.8,21.97
  Bottom 0.203: v10.36,20.57 10.77,20.98
  Bottom 0.254: 10.77,20.98 18.49,20.98 v18.54,20.93 | v36.8,21.97 41.25,21.95 v42.22,20.98

### Text on the board
tPlace: Andrew Robinson | U Michigan | 2011/2/10 | aether | EX0 | EX1 | CHG
bPlace: VCHG | USER | RESET | GND | GND